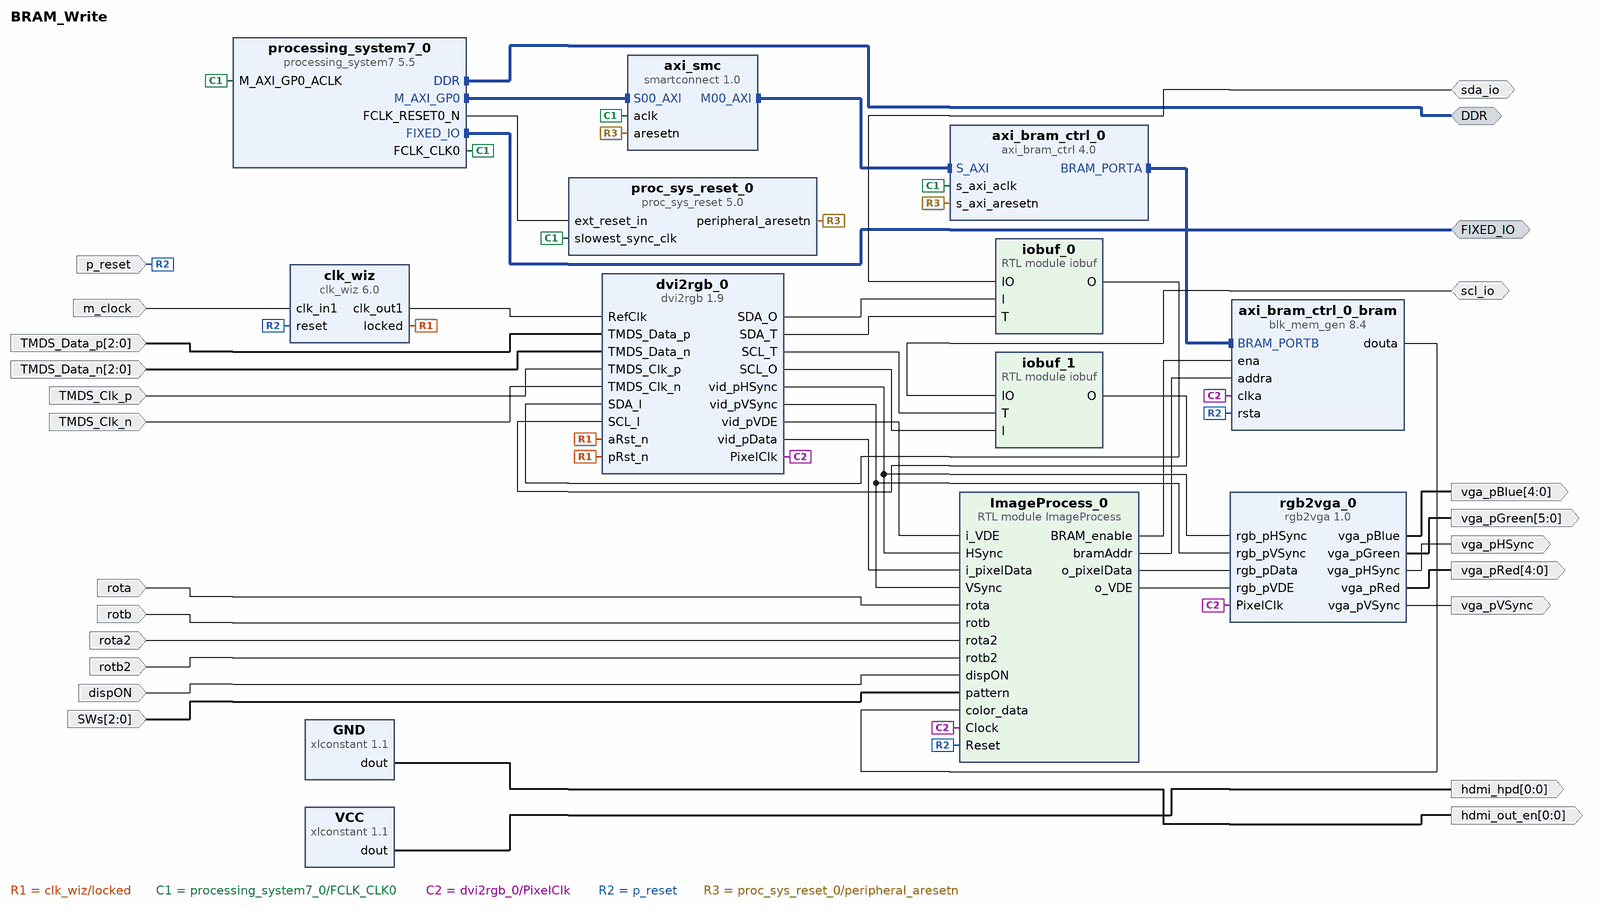
[diagram p0: block diagram of the top level]
# Vivado block design BRAM_Write, xc7z010clg400-1, Vivado 2018.2
create_bd_design BRAM_Write

create_bd_intf_port -mode Master -vlnv xilinx.com:interface:ddrx_rtl:1.0 DDR
create_bd_intf_port -mode Master -vlnv xilinx.com:display_processing_system7:fixedio_rtl:1.0 FIXED_IO
create_bd_port -dir I -from 2 -to 0 TMDS_Data_p
create_bd_port -dir I -from 2 -to 0 TMDS_Data_n
create_bd_port -dir O -from 0 -to 0 hdmi_out_en
create_bd_port -dir O -from 0 -to 0 hdmi_hpd
create_bd_port -dir O -from 4 -to 0 vga_pRed
create_bd_port -dir O -from 5 -to 0 vga_pGreen
create_bd_port -dir O -from 4 -to 0 vga_pBlue
create_bd_port -dir O vga_pHSync
create_bd_port -dir O vga_pVSync
create_bd_port -dir IO scl_io
create_bd_port -dir IO sda_io
create_bd_port -dir I TMDS_Clk_p
create_bd_port -dir I TMDS_Clk_n
create_bd_port -dir I -type clk m_clock
set_property -dict {CONFIG.FREQ_HZ 125000000} [get_bd_ports m_clock]
create_bd_port -dir I rota
create_bd_port -dir I rotb
create_bd_port -dir I rota2
create_bd_port -dir I rotb2
create_bd_port -dir I dispON
create_bd_port -dir I -from 2 -to 0 SWs
create_bd_port -dir I -type rst p_reset
set_property -dict {CONFIG.POLARITY ACTIVE_HIGH} [get_bd_ports p_reset]

create_bd_cell -type ip -vlnv xilinx.com:ip:clk_wiz:6.0 clk_wiz
set_property -dict [list \
  CONFIG.PRIMITIVE PLL \
  CONFIG.PRIM_IN_FREQ 125.000 \
  CONFIG.USE_INCLK_SWITCHOVER false \
  CONFIG.SECONDARY_IN_FREQ 100.000 \
  CONFIG.SECONDARY_SOURCE Single_ended_clock_capable_pin \
  CONFIG.CLKIN1_JITTER_PS 80.0 \
  CONFIG.CLKIN2_JITTER_PS 99.99000000000001 \
  CONFIG.CLKOUT2_USED false \
  CONFIG.NUM_OUT_CLKS 1 \
  CONFIG.CLKOUT1_REQUESTED_OUT_FREQ 200.000 \
  CONFIG.CLKOUT2_REQUESTED_OUT_FREQ 100.000 \
  CONFIG.CLKOUT1_DRIVES BUFG \
  CONFIG.CLKOUT2_DRIVES BUFG \
  CONFIG.CLKOUT3_DRIVES BUFG \
  CONFIG.CLKOUT4_DRIVES BUFG \
  CONFIG.CLKOUT5_DRIVES BUFG \
  CONFIG.CLKOUT6_DRIVES BUFG \
  CONFIG.CLKOUT7_DRIVES BUFG \
  CONFIG.FEEDBACK_SOURCE FDBK_AUTO \
  CONFIG.MMCM_DIVCLK_DIVIDE 1 \
  CONFIG.MMCM_CLKFBOUT_MULT_F 8 \
  CONFIG.MMCM_CLKIN1_PERIOD 8.000 \
  CONFIG.MMCM_CLKIN2_PERIOD 10.0 \
  CONFIG.MMCM_COMPENSATION ZHOLD \
  CONFIG.MMCM_CLKOUT0_DIVIDE_F 5 \
  CONFIG.MMCM_CLKOUT1_DIVIDE 1 \
  CONFIG.CLK_IN1_BOARD_INTERFACE sys_clock \
  CONFIG.CLK_IN2_BOARD_INTERFACE Custom \
  CONFIG.CLKOUT1_JITTER 109.241 \
  CONFIG.CLKOUT1_PHASE_ERROR 96.948 \
  CONFIG.CLKOUT2_JITTER 165.419 \
  CONFIG.CLKOUT2_PHASE_ERROR 96.948 \
] [get_bd_cells clk_wiz]
create_bd_cell -type ip -vlnv xilinx.com:ip:xlconstant:1.1 GND
set_property -dict {CONFIG.CONST_VAL 0} [get_bd_cells GND]
create_bd_cell -type ip -vlnv xilinx.com:ip:xlconstant:1.1 VCC
create_bd_cell -type ip -vlnv digilentinc.com:ip:rgb2vga:1.0 rgb2vga_0
create_bd_cell -type ip -vlnv digilentinc.com:ip:dvi2rgb:1.9 dvi2rgb_0
set_property -dict {CONFIG.kEnableSerialClkOutput false CONFIG.kRstActiveHigh false CONFIG.kClkRange 2} [get_bd_cells dvi2rgb_0]
create_bd_cell -type module -reference iobuf iobuf_0
create_bd_cell -type module -reference iobuf iobuf_1
create_bd_cell -type ip -vlnv xilinx.com:ip:processing_system7:5.5 processing_system7_0
set_property -dict [list \
  CONFIG.PCW_UIPARAM_DDR_FREQ_MHZ 525 \
  CONFIG.PCW_CRYSTAL_PERIPHERAL_FREQMHZ 50.000000 \
  CONFIG.PCW_APU_PERIPHERAL_FREQMHZ 650 \
  CONFIG.PCW_UART_PERIPHERAL_FREQMHZ 100 \
  CONFIG.PCW_FPGA0_PERIPHERAL_FREQMHZ 120 \
  CONFIG.PCW_FPGA1_PERIPHERAL_FREQMHZ 50 \
  CONFIG.PCW_PERIPHERAL_BOARD_PRESET part0 \
  CONFIG.PCW_PRESET_BANK1_VOLTAGE {LVCMOS 1.8V} \
  CONFIG.PCW_UIPARAM_DDR_PARTNO {MT41K128M16 JT-125} \
  CONFIG.PCW_QSPI_PERIPHERAL_ENABLE 1 \
  CONFIG.PCW_QSPI_QSPI_IO {MIO 1 .. 6} \
  CONFIG.PCW_QSPI_GRP_SINGLE_SS_ENABLE 1 \
  CONFIG.PCW_QSPI_GRP_SINGLE_SS_IO {MIO 1 .. 6} \
  CONFIG.PCW_SINGLE_QSPI_DATA_MODE x4 \
  CONFIG.PCW_QSPI_GRP_FBCLK_ENABLE 1 \
  CONFIG.PCW_QSPI_GRP_FBCLK_IO {MIO 8} \
  CONFIG.PCW_ENET0_PERIPHERAL_ENABLE 0 \
  CONFIG.PCW_SD0_PERIPHERAL_ENABLE 0 \
  CONFIG.PCW_UART1_PERIPHERAL_ENABLE 1 \
  CONFIG.PCW_UART1_UART1_IO {MIO 48 .. 49} \
  CONFIG.PCW_TTC0_PERIPHERAL_ENABLE 1 \
  CONFIG.PCW_TTC0_TTC0_IO EMIO \
  CONFIG.PCW_USB0_PERIPHERAL_ENABLE 0 \
  CONFIG.PCW_USB_RESET_ENABLE 1 \
  CONFIG.PCW_I2C_RESET_ENABLE 1 \
  CONFIG.PCW_GPIO_MIO_GPIO_ENABLE 1 \
  CONFIG.PCW_GPIO_MIO_GPIO_IO MIO \
] [get_bd_cells processing_system7_0]
# 492 more settings of processing_system7_0 are not shown: defaults, MIO pin electricals, DDR timing, and values the tool derives
create_bd_cell -type ip -vlnv xilinx.com:ip:axi_bram_ctrl:4.0 axi_bram_ctrl_0
set_property -dict {CONFIG.SINGLE_PORT_BRAM 1} [get_bd_cells axi_bram_ctrl_0]
create_bd_cell -type ip -vlnv xilinx.com:ip:smartconnect:1.0 axi_smc
set_property -dict {CONFIG.NUM_SI 1} [get_bd_cells axi_smc]
create_bd_cell -type ip -vlnv xilinx.com:ip:blk_mem_gen:8.4 axi_bram_ctrl_0_bram
set_property -dict [list \
  CONFIG.Memory_Type True_Dual_Port_RAM \
  CONFIG.Enable_B Use_ENB_Pin \
  CONFIG.Use_RSTB_Pin true \
  CONFIG.Port_A_Write_Rate 50 \
  CONFIG.Port_B_Clock 100 \
  CONFIG.Port_B_Write_Rate 50 \
  CONFIG.Port_B_Enable_Rate 100 \
] [get_bd_cells axi_bram_ctrl_0_bram]
create_bd_cell -type ip -vlnv xilinx.com:ip:proc_sys_reset:5.0 proc_sys_reset_0
create_bd_cell -type module -reference ImageProcess ImageProcess_0

# ---- connections ----

connect_bd_intf_net [get_bd_intf_pins processing_system7_0/M_AXI_GP0] [get_bd_intf_pins axi_smc/S00_AXI]
connect_bd_intf_net [get_bd_intf_pins axi_smc/M00_AXI] [get_bd_intf_pins axi_bram_ctrl_0/S_AXI]
connect_bd_intf_net [get_bd_intf_pins axi_bram_ctrl_0/BRAM_PORTA] [get_bd_intf_pins axi_bram_ctrl_0_bram/BRAM_PORTB]
connect_bd_intf_net [get_bd_intf_ports DDR] [get_bd_intf_pins processing_system7_0/DDR]
connect_bd_intf_net [get_bd_intf_ports FIXED_IO] [get_bd_intf_pins processing_system7_0/FIXED_IO]
connect_bd_net [get_bd_pins clk_wiz/clk_out1] [get_bd_pins dvi2rgb_0/RefClk]
connect_bd_net -net TMDS_Data_p_1_1 [get_bd_ports TMDS_Data_p] [get_bd_pins dvi2rgb_0/TMDS_Data_p]
connect_bd_net -net TMDS_Data_n_1_1 [get_bd_ports TMDS_Data_n] [get_bd_pins dvi2rgb_0/TMDS_Data_n]
connect_bd_net [get_bd_pins GND/dout] [get_bd_ports hdmi_out_en]
connect_bd_net [get_bd_pins VCC/dout] [get_bd_ports hdmi_hpd]
connect_bd_net [get_bd_pins dvi2rgb_0/vid_pHSync] [get_bd_pins rgb2vga_0/rgb_pHSync] [get_bd_pins ImageProcess_0/HSync]
connect_bd_net [get_bd_pins dvi2rgb_0/vid_pVSync] [get_bd_pins rgb2vga_0/rgb_pVSync] [get_bd_pins ImageProcess_0/VSync]
connect_bd_net [get_bd_pins rgb2vga_0/vga_pRed] [get_bd_ports vga_pRed]
connect_bd_net [get_bd_pins rgb2vga_0/vga_pGreen] [get_bd_ports vga_pGreen]
connect_bd_net [get_bd_pins rgb2vga_0/vga_pBlue] [get_bd_ports vga_pBlue]
connect_bd_net [get_bd_pins rgb2vga_0/vga_pHSync] [get_bd_ports vga_pHSync]
connect_bd_net [get_bd_pins rgb2vga_0/vga_pVSync] [get_bd_ports vga_pVSync]
connect_bd_net [get_bd_ports scl_io] [get_bd_pins iobuf_1/IO]
connect_bd_net [get_bd_ports sda_io] [get_bd_pins iobuf_0/IO]
connect_bd_net [get_bd_pins iobuf_1/O] [get_bd_pins dvi2rgb_0/SCL_I]
connect_bd_net [get_bd_pins dvi2rgb_0/SCL_T] [get_bd_pins iobuf_1/T]
connect_bd_net [get_bd_pins dvi2rgb_0/SCL_O] [get_bd_pins iobuf_1/I]
connect_bd_net [get_bd_pins iobuf_0/O] [get_bd_pins dvi2rgb_0/SDA_I]
connect_bd_net [get_bd_pins dvi2rgb_0/SDA_O] [get_bd_pins iobuf_0/I]
connect_bd_net [get_bd_pins dvi2rgb_0/SDA_T] [get_bd_pins iobuf_0/T]
connect_bd_net [get_bd_ports TMDS_Clk_p] [get_bd_pins dvi2rgb_0/TMDS_Clk_p]
connect_bd_net [get_bd_ports TMDS_Clk_n] [get_bd_pins dvi2rgb_0/TMDS_Clk_n]
connect_bd_net [get_bd_pins clk_wiz/locked] [get_bd_pins dvi2rgb_0/aRst_n] [get_bd_pins dvi2rgb_0/pRst_n]
connect_bd_net [get_bd_ports m_clock] [get_bd_pins clk_wiz/clk_in1]
connect_bd_net [get_bd_pins dvi2rgb_0/vid_pVDE] [get_bd_pins ImageProcess_0/i_VDE]
connect_bd_net [get_bd_pins dvi2rgb_0/vid_pData] [get_bd_pins ImageProcess_0/i_pixelData]
connect_bd_net [get_bd_pins ImageProcess_0/o_pixelData] [get_bd_pins rgb2vga_0/rgb_pData]
connect_bd_net [get_bd_pins ImageProcess_0/o_VDE] [get_bd_pins rgb2vga_0/rgb_pVDE]
connect_bd_net [get_bd_pins processing_system7_0/FCLK_CLK0] \
  [get_bd_pins processing_system7_0/M_AXI_GP0_ACLK] [get_bd_pins axi_smc/aclk] [get_bd_pins axi_bram_ctrl_0/s_axi_aclk] \
  [get_bd_pins proc_sys_reset_0/slowest_sync_clk]
connect_bd_net -net rota_0_1 [get_bd_ports rota] [get_bd_pins ImageProcess_0/rota]
connect_bd_net -net rotb_0_1 [get_bd_ports rotb] [get_bd_pins ImageProcess_0/rotb]
connect_bd_net -net rota2_0_1 [get_bd_ports rota2] [get_bd_pins ImageProcess_0/rota2]
connect_bd_net -net rotb2_0_1 [get_bd_ports rotb2] [get_bd_pins ImageProcess_0/rotb2]
connect_bd_net -net dispON_0_1 [get_bd_ports dispON] [get_bd_pins ImageProcess_0/dispON]
connect_bd_net -net pattern_0_1 [get_bd_ports SWs] [get_bd_pins ImageProcess_0/pattern]
connect_bd_net [get_bd_pins dvi2rgb_0/PixelClk] \
  [get_bd_pins rgb2vga_0/PixelClk] [get_bd_pins axi_bram_ctrl_0_bram/clka] [get_bd_pins ImageProcess_0/Clock]
connect_bd_net [get_bd_ports p_reset] [get_bd_pins clk_wiz/reset] [get_bd_pins axi_bram_ctrl_0_bram/rsta] [get_bd_pins ImageProcess_0/Reset]
connect_bd_net -net rst_ps7_0_100M_peripheral_aresetn [get_bd_pins proc_sys_reset_0/peripheral_aresetn] \
  [get_bd_pins axi_bram_ctrl_0/s_axi_aresetn] [get_bd_pins axi_smc/aresetn]
connect_bd_net [get_bd_pins axi_bram_ctrl_0_bram/douta] [get_bd_pins ImageProcess_0/color_data]
connect_bd_net [get_bd_pins ImageProcess_0/BRAM_enable] [get_bd_pins axi_bram_ctrl_0_bram/ena]
connect_bd_net [get_bd_pins ImageProcess_0/bramAddr] [get_bd_pins axi_bram_ctrl_0_bram/addra]
connect_bd_net [get_bd_pins processing_system7_0/FCLK_RESET0_N] [get_bd_pins proc_sys_reset_0/ext_reset_in]

# ---- address map ----
assign_bd_address -offset 0x40000000 -range 64K -target_address_space [get_bd_addr_spaces processing_system7_0/Data] [get_bd_addr_segs axi_bram_ctrl_0/S_AXI/Mem0]

validate_bd_design
save_bd_design
